# Altium schematic sheet MocKhoaLedTraiTim.SchDoc
size A
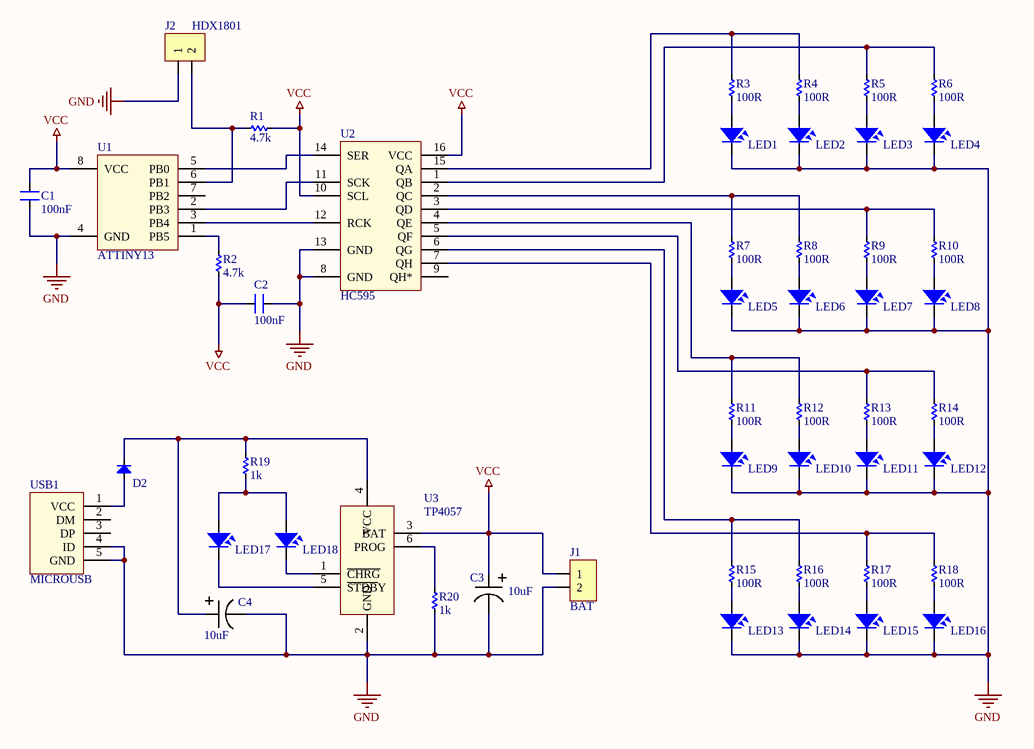
[diagram p0: MocKhoaLedTraiTim.SchDoc]

## Parts
C1  100nF  [CN-SMD-0805]
C2  100nF  [CN-SMD-0805]
C3  10uF  [CAP1411]
C4  10uF  [CAP1411]
D2  Diode SMD  [DIO-SMD-123]  (value not drawn)
J1  BAT  [JP2-D1T]
J2  HDX1801  [JP2-D1T]
LED1  LED  [LED-1206-Yellow]  (value not drawn)
LED2  LED  [LED-1206-Yellow]  (value not drawn)
LED3  LED  [LED-1206-Yellow]  (value not drawn)
LED4  LED  [LED-1206-Yellow]  (value not drawn)
LED5  LED  [LED-1206-Yellow]  (value not drawn)
LED6  LED  [LED-1206-Yellow]  (value not drawn)
LED7  LED  [LED-1206-Yellow]  (value not drawn)
LED8  LED  [LED-1206-Yellow]  (value not drawn)
LED9  LED  [LED-1206-Yellow]  (value not drawn)
LED10  LED  [LED-1206-Yellow]  (value not drawn)
LED11  LED  [LED-1206-Yellow]  (value not drawn)
LED12  LED  [LED-1206-Yellow]  (value not drawn)
LED13  LED  [LED-1206-Yellow]  (value not drawn)
LED14  LED  [LED-1206-Yellow]  (value not drawn)
LED15  LED  [LED-1206-Yellow]  (value not drawn)
LED16  LED  [LED-1206-Yellow]  (value not drawn)
LED17  LED  [LED-0805-Yellow]  (value not drawn)
LED18  LED  [LED-0805-Yellow]  (value not drawn)
R1  4.7k  [RES-SMD-0805]
R2  4.7k  [RES-SMD-0805]
R3  100R  [RES-SMD-0805]
R4  100R  [RES-SMD-0805]
R5  100R  [RES-SMD-0805]
R6  100R  [RES-SMD-0805]
R7  100R  [RES-SMD-0805]
R8  100R  [RES-SMD-0805]
R9  100R  [RES-SMD-0805]
R10  100R  [RES-SMD-0805]
R11  100R  [RES-SMD-0805]
R12  100R  [RES-SMD-0805]
R13  100R  [RES-SMD-0805]
R14  100R  [RES-SMD-0805]
R15  100R  [RES-SMD-0805]
R16  100R  [RES-SMD-0805]
R17  100R  [RES-SMD-0805]
R18  100R  [RES-SMD-0805]
R19  1k  [RES-SMD-0805]
R20  1k  [RES-SMD-0805]
U1  ATTINY13  [TINY13]
U2  HC595  [SOP16]
U3  TP4057  [SOT23-6]
USB1  MICROUSB  [MICROUSB]

## Nets
GND: C1.1 C2.1 C3.2 C4.2 J1.2 J2.1 LED1.2 LED2.2 LED3.2 LED4.2 LED5.2 LED6.2 LED7.2 LED8.2 LED9.2 LED10.2 LED11.2 LED12.2 LED13.2 LED14.2 LED15.2 LED16.2 R20.1 U1.4(GND) U2.8(GND) U2.13(GND) U3.2(GND) USB1.4(ID) USB1.5(GND)
VCC: C1.2 C2.2 C3.1 J1.1 R1.2 R2.2 U1.8(VCC) U2.10(SCL) U2.16(VCC) U3.3(BAT)
NetC4_1: C4.1 D2.2(K) R19.2 U3.4(VCC)
NetD2_1: D2.1(A) USB1.1(VCC)
NetJ2_2: J2.2 R1.1 U1.6(PB1)
NetLED1_1: LED1.1 R3.1
NetLED2_1: LED2.1 R4.1
NetLED3_1: LED3.1 R5.1
NetLED4_1: LED4.1 R6.1
NetLED5_1: LED5.1 R7.1
NetLED6_1: LED6.1 R8.1
NetLED7_1: LED7.1 R9.1
NetLED8_1: LED8.1 R10.1
NetLED9_1: LED9.1 R11.1
NetLED10_1: LED10.1 R12.1
NetLED11_1: LED11.1 R13.1
NetLED12_1: LED12.1 R14.1
NetLED13_1: LED13.1 R15.1
NetLED14_1: LED14.1 R16.1
NetLED15_1: LED15.1 R17.1
NetLED16_1: LED16.1 R18.1
NetLED17_1: LED17.1 LED18.1 R19.1
NetLED17_2: LED17.2 U3.5(~{STDB}Y)
NetLED18_2: LED18.2 U3.1(~{CHRG})
NetR2_1: R2.1 U1.1(PB5)
NetR3_2: R3.2 R4.2 U2.15(QA)
NetR5_2: R5.2 R6.2 U2.1(QB)
NetR7_2: R7.2 R8.2 U2.2(QC)
NetR9_2: R9.2 R10.2 U2.3(QD)
NetR11_2: R11.2 R12.2 U2.4(QE)
NetR13_2: R13.2 R14.2 U2.5(QF)
NetR15_2: R15.2 R16.2 U2.6(QG)
NetR17_2: R17.2 R18.2 U2.7(QH)
NetR20_2: R20.2 U3.6(PROG)
NetU1_2: U1.2(PB3) U2.11(SCK)
NetU1_3: U1.3(PB4) U2.12(RCK)
NetU1_5: U1.5(PB0) U2.14(SER)

Not connected (* = marked no-connect by the designer): U1 7(PB2); U2 9(QH*); USB1 2(DM) 3(DP)

## Library data of the parts
C1 C2 = CN: Value: 33pF
C3 C4 = CAP-TANTALUM
D2 = Diode SMD: Default Diode; Code - JEDEC: DO-214-AB; Value: 1N5007; Published: 8-Jun-2000; Revision: July-2002: Re-released for DXP Platform.; Publisher: Altium Limited
J1 J2 = JP2: WR-PHD 2.54 mm Angled Socket Header; Manufacturer: W¨¹rth Elektronik eiSos GmbH; partNo: 613002143121; ComponentLink1 Description: Manufacturer; ComponentLink2 Description: Datasheet; NoPins: 02; Created Date: 29 March 2013; ComponentLink1URL: http://www.we-online.com; ComponentLink2URL: http://katalog.we-online.de/em/datasheet/6130xx143121.pdf; Created by: Karrer Zheng
LED1-LED18 = LED SMD: Value: LED 3 - 5 ly 2 Colour
R1-R20 = Res-SMD: Resistor; Manufacturer: Generic Components; Class: Passive; Published: 08/06/2000; Publisher: Altium Hobart Technology Centre
U1 = TINY13